# Altium schematic sheet Chua_circuit.SchDoc
size A4
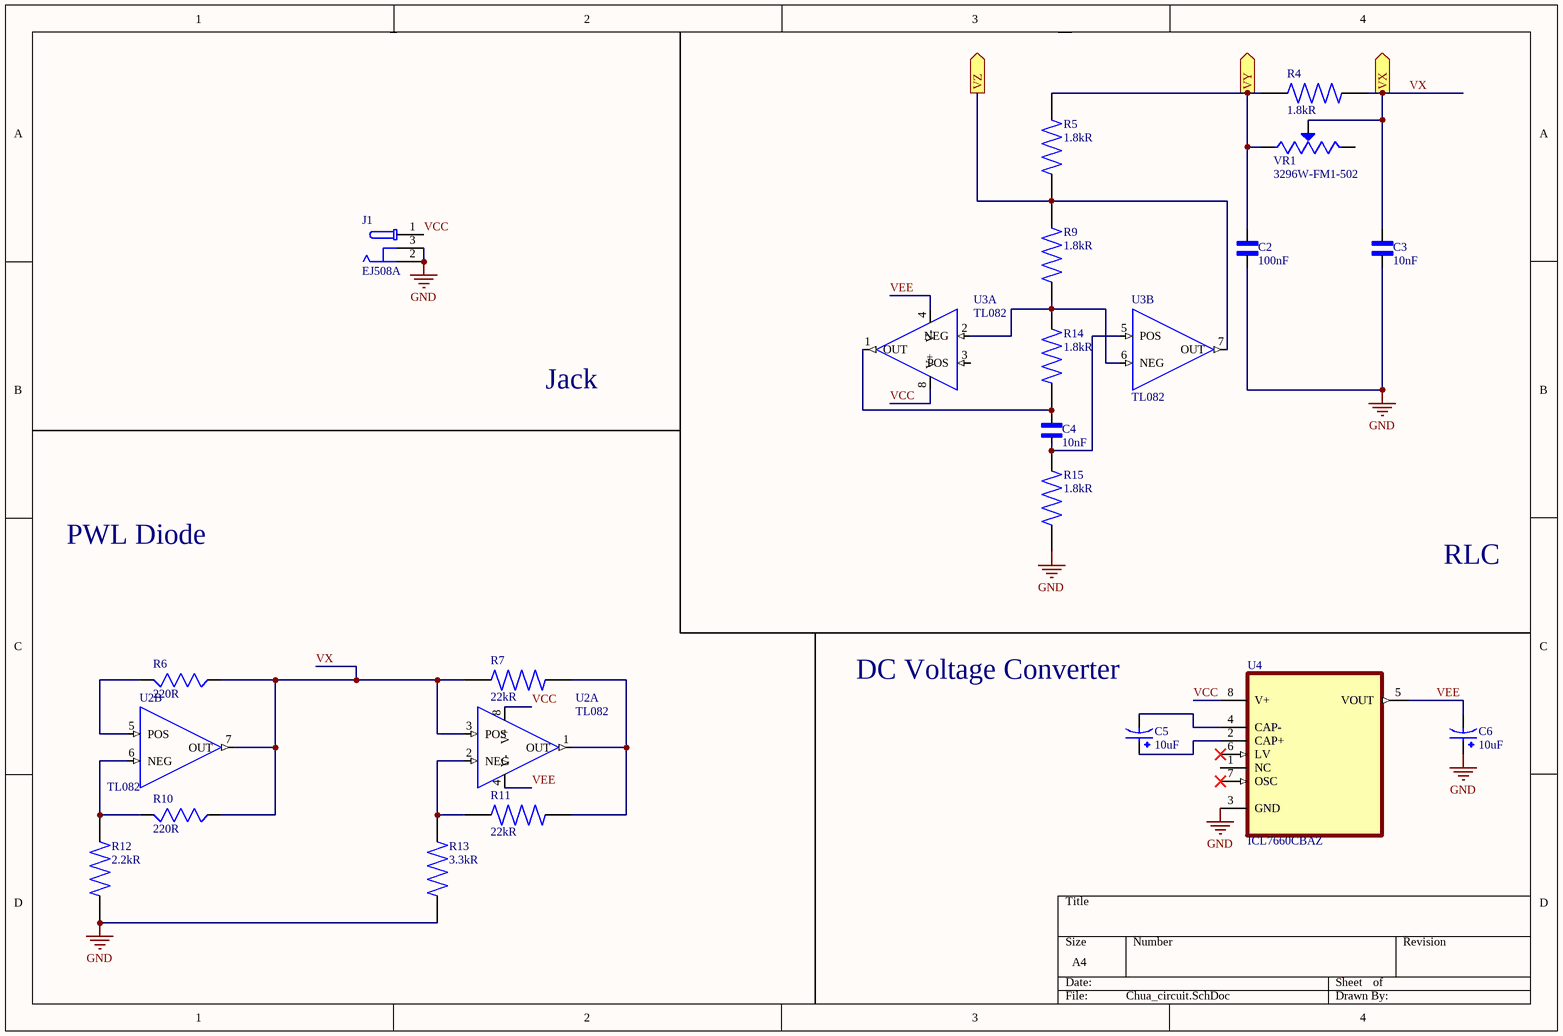
[diagram p0: Chua_circuit.SchDoc]

## Parts
C2  100nF  [CAPC3216X100N]
C3  10nF  [CAPC1608X90N]
C4  10nF  [CAPC1608X90N]
C5  10uF  [CAP_EEEFN1J100L]
C6  10uF  [CAP_EEEFN1J100L]
J1  EJ508A  [MPD_EJ508A]
R4  1.8kR  [RES_ERJU08F1801V]
R5  1.8kR  [RES_ERJU08F1801V]
R6  220R  [RESC2012X60N]
R7  22kR  [RES_ERA3AED223V]
R9  1.8kR  [RES_ERJU08F1801V]
R10  220R  [RESC2012X60N]
R11  22kR  [RES_ERA3AED223V]
R12  2.2kR  [RESC1608X55N]
R13  3.3kR  [RESC1608X55N]
R14  1.8kR  [RES_ERJU08F1801V]
R15  1.8kR  [RES_ERJU08F1801V]
U2  TL082  [SOIC127P600X175-8N]  (parts A,B of 2)
U3  TL082  [SOIC127P600X175-8N]  (parts A,B of 2)
U4  ICL7660CBAZ  [SOIC127P600X175-8N]
VR1  3296W-FM1-502  [TRIM_3296W-FM1-502]

## Ports
VX (out), VY (out), VZ (out)

## Nets
GND: C2.1 C3.1 C6.1 J1.2 J1.3 R12.2 R13.1 R15.1 U4.3(GND)
VCC: J1.1 U2.8(V+) U3.8(V+) U4.8(V+)
VEE: C6.2 U2.4(V-) U3.4(V-) U4.5(VOUT)
VX: C3.2 R4.2 R6.2 R7.1 R10.2 U2.3(POS) U2.7(OUT) VR1.2(WIPER) ; port VX
VY: C2.2 R4.1 R5.2 VR1.1(CCW) ; port VY
VZ: R5.1 R9.2 U3.7(OUT) ; port VZ
NetC4_1: C4.1 R15.2 U3.5(POS)
NetC4_2: C4.2 R14.1 U3.1(OUT)
NetC5_1: C5.1 U4.2(CAP+)
NetC5_2: C5.2 U4.4(CAP-)
NetR6_1: R6.1 U2.5(POS)
NetR7_2: R7.2 R11.2 U2.1(OUT)
NetR9_1: R9.1 R14.2 U3.2(NEG) U3.6(NEG)
NetR10_1: R10.1 R12.1 U2.6(NEG)
NetR11_1: R11.1 R13.2 U2.2(NEG)

Not connected (* = marked no-connect by the designer): U3 3(POS); U4 1(NC) 6(LV)* 7(OSC)*; VR1 3(CW)

## Notes on the sheet
- Jack
- PWL Diode
- RLC
- (near C5) DC Voltage Converter

## Library data of the parts
C2 = CL31B104KBCNNNC: Ceramic capacitor SMD 1206 100 nF 50 V 10 % Samsung Electro-Mechanics CL31B104KBCNNNC 4000 pc(s); SnapEDA_Link: https://www.snapeda.com/parts/CL31B104KBCNNNC/Samsung/view-part/?ref=snap; Package: SMD-2 Samsung; Value: *; MF: Samsung Electro-Mechanics; MP: CL31B104KBCNNNC; Check_prices: https://www.snapeda.com/parts/CL31B104KBCNNNC/Samsung/view-part/?ref=eda
C3 C4 = 06033C103KAT2A: 0603 X7R ceramic capacitor,10nF 25V | AVX 06033C103KAT2A; SnapEDA_Link: https://www.snapeda.com/parts/06033C103KAT2A/AVX/view-part/?ref=snap; Package: 1608 AVX; Value: *; MF: AVX; MP: 06033C103KAT2A; Check_prices: https://www.snapeda.com/parts/06033C103KAT2A/AVX/view-part/?ref=eda
C5 C6 = EEEFN1J100L: CAP ALUM 10UF 20% 63V SMD; MF: Panasonic; SnapEDA_Link: https://www.snapeda.com/parts/EEEFN1J100L/Panasonic/view-part/?ref=snap; Package: RADIAL-2 Panasonic; Value: *; MP: EEEFN1J100L; Check_prices: https://www.snapeda.com/parts/EEEFN1J100L/Panasonic/view-part/?ref=eda
J1 = EJ508A: Power Barrel Connector Jack 2.10mm ID _0.083_, 5.50mm OD _0.217_ Through Hole, Right Angle; MF: MPD; Package: Non-Standard MPD; Value: *; SnapEDA_Link: https://www.snapeda.com/parts/EJ508A/MPD%20%28Memory%20Protection%20Devices%29/view-part/474399/?ref=snap; Price: None; MP: EJ508A; Availability: Unavailable
R4 R5 R9 R14 R15 = ERJU08F1801V: Availability: Unavailable; Price: None; Package: None; Value: *; MP: ERJU08F1801V
R6 R10 = RC0805FR-10220KL: 220 kOhms Â±1% 0.125W, 1/8W Chip Resistor 0805 (2012 Metric) - Thick Film; MF: Yageo; MP: RC0805FR-10220KL; SnapEDA_Link: https://www.snapeda.com/parts/RC0805FR-10220KL/Yageo/view-part/?ref=snap; Availability: In Stock; Package: 0805 Yageo; Purchase-URL: https://pricing.snapeda.com/search/part/RC0805FR-10220KL/?ref=eda; Check_prices: https://www.snapeda.com/parts/RC0805FR-10220KL/Yageo/view-part/?ref=eda; Value: *; Price: None
R7 R11 = ERA3AED223V: Availability: Unavailable; Value: *; Price: None; MP: ERA3AED223V; Package: None
R12 = CR0603-JW-222ELF: Res 0603 2k2 5% 100mW | Bourns CR0603-JW-222ELF; SnapEDA_Link: https://www.snapeda.com/parts/CR0603-JW-222ELF/Bourns/view-part/?ref=snap; Package: 0603-2 Bourns; Value: *; MF: Bourns; MP: CR0603-JW-222ELF; Check_prices: https://www.snapeda.com/parts/CR0603-JW-222ELF/Bourns/view-part/?ref=eda
R13 = CR0603-FX-3301ELF: CR0603 SMD Thick Film Resistor,3K3 1% | Bourns CR0603-FX-3301ELF; SnapEDA_Link: https://www.snapeda.com/parts/CR0603-FX-3301ELF/Bourns/view-part/?ref=snap; Package: 0603-2 Bourns; Value: *; MF: Bourns; MP: CR0603-FX-3301ELF; Check_prices: https://www.snapeda.com/parts/CR0603-FX-3301ELF/Bourns/view-part/?ref=eda
U2 U3 = TL082: GENERAL PURPOSE J-FET DUAL OPERATIONAL AMPLIFIERS; MF: STMicroelectronics; SnapEDA_Link: https://www.snapeda.com/parts/TL082/STMicroelectronics/view-part/?ref=snap; Package: None; Value: *; MP: TL082; Check_prices: https://www.snapeda.com/parts/TL082/STMicroelectronics/view-part/?ref=eda
U4 = ICL7660CBAZ: Charge Pump Switching Regulator IC Positive or Negative Fixed -Vin, 2Vin 1 Output 45mA 8-SOIC (0.154, 3.90mm Width); MF: Renesas Electronics America Inc; SnapEDA_Link: https://www.snapeda.com/parts/ICL7660CBAZ/Renesas/view-part/?ref=snap; Package: SOIC-8 Renesas Electronics America Inc; Value: *; MP: ICL7660CBAZ; Check_prices: https://www.snapeda.com/parts/ICL7660CBAZ/Renesas/view-part/?ref=eda
VR1 = 3296W-FM1-502: Trimmer Resistors - Through Hole; MF: Bourns; SnapEDA_Link: https://www.snapeda.com/parts/3296W-FM1-502/Bourns/view-part/?ref=snap; Package: SOT-23-5 Bourns; Value: *; MP: 3296W-FM1-502; Check_prices: https://www.snapeda.com/parts/3296W-FM1-502/Bourns/view-part/?ref=eda